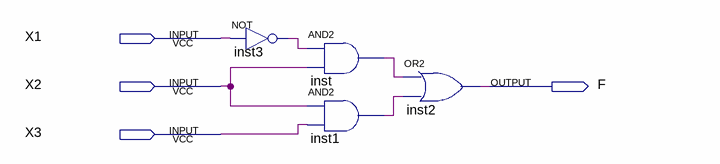
[diagram p0: schematic sheet]
// Quartus schematic main.bdf as structural Verilog: 4 symbols, 4 pins
module main (
  input  X1,
  input  X2,
  input  X3,
  output F
);

  wire inst1_out, inst3_out, inst_out;

  not inst3 (inst3_out, X1);
  and inst (inst_out, inst3_out, X2);
  and inst1 (inst1_out, X2, X3);
  or inst2 (F, inst_out, inst1_out);
endmodule
